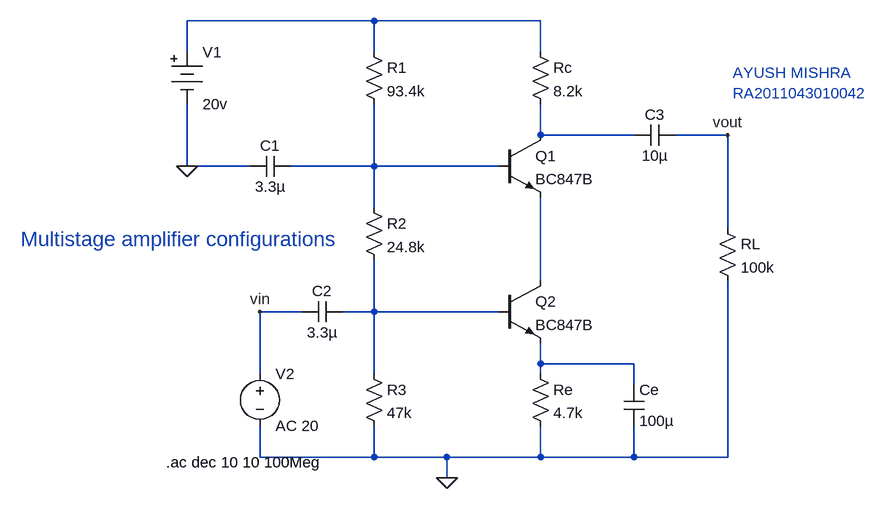
[diagram p0: schematic exp 3.asc]
exp 3.asc, the LTspice schematic file:
Version 4
SHEET 1 880 680
WIRE -16 -144 -304 -144
WIRE 240 -144 -16 -144
WIRE -304 -96 -304 -144
WIRE -16 -96 -16 -144
WIRE 240 -96 240 -144
WIRE 240 32 240 -16
WIRE 384 32 240 32
WIRE 528 32 448 32
WIRE -304 80 -304 -16
WIRE -208 80 -304 80
WIRE -16 80 -16 -16
WIRE -16 80 -144 80
WIRE 176 80 -16 80
WIRE -16 144 -16 80
WIRE 528 176 528 32
WIRE 240 256 240 128
WIRE -128 304 -192 304
WIRE -16 304 -16 224
WIRE -16 304 -64 304
WIRE 176 304 -16 304
WIRE 240 384 240 352
WIRE 384 384 240 384
WIRE -192 400 -192 304
WIRE -16 400 -16 304
WIRE 240 400 240 384
WIRE 384 416 384 384
WIRE -192 528 -192 480
WIRE -16 528 -16 480
WIRE -16 528 -192 528
WIRE 96 528 -16 528
WIRE 240 528 240 480
WIRE 240 528 96 528
WIRE 384 528 384 480
WIRE 384 528 240 528
WIRE 528 528 528 256
WIRE 528 528 384 528
WIRE 96 560 96 528
FLAG 96 560 0
FLAG -304 80 0
FLAG 528 32 vout
FLAG -192 304 vin
SYMBOL npn 176 32 R0
SYMATTR InstName Q1
SYMATTR Value BC847B
SYMBOL npn 176 256 R0
SYMATTR InstName Q2
SYMATTR Value BC847B
SYMBOL res -32 -112 R0
SYMATTR InstName R1
SYMATTR Value 93.4k
SYMBOL res -32 128 R0
SYMATTR InstName R2
SYMATTR Value 24.8k
SYMBOL res -32 384 R0
SYMATTR InstName R3
SYMATTR Value 47k
SYMBOL res 224 -112 R0
SYMATTR InstName Rc
SYMATTR Value 8.2k
SYMBOL res 224 384 R0
SYMATTR InstName Re
SYMATTR Value 4.7k
SYMBOL res 512 160 R0
SYMATTR InstName RL
SYMATTR Value 100k
SYMBOL Misc\\battery -304 -112 R0
WINDOW 123 0 0 Left 0
WINDOW 39 0 0 Left 0
SYMATTR InstName V1
SYMATTR Value 20v
SYMBOL voltage -192 384 R0
WINDOW 123 0 0 Left 0
WINDOW 39 0 0 Left 0
SYMATTR InstName V2
SYMATTR Value AC 20
SYMBOL cap -144 64 R90
WINDOW 0 0 32 VBottom 2
WINDOW 3 32 32 VTop 2
SYMATTR InstName C1
SYMATTR Value 3.3µ
SYMBOL cap -64 288 R90
WINDOW 0 0 32 VBottom 2
WINDOW 3 32 32 VTop 2
SYMATTR InstName C2
SYMATTR Value 3.3µ
SYMBOL cap 448 16 R90
WINDOW 0 0 32 VBottom 2
WINDOW 3 32 32 VTop 2
SYMATTR InstName C3
SYMATTR Value 10µ
SYMBOL cap 368 416 R0
SYMATTR InstName Ce
SYMATTR Value 100µ
TEXT -336 536 Left 2 !.ac dec 10 10 100Meg
TEXT 536 -64 Left 2 ;AYUSH MISHRA\nRA2011043010042
TEXT -560 192 Left 3 ;Multistage amplifier configurations

The netlist it stands for:
* exp 3.asc
Q1 N002 N003 N004 0 BC847B
Q2 N004 N005 N006 0 BC847B
R1 N001 N003 93.4k
R2 N003 N005 24.8k
R3 N005 0 47k
Rc N001 N002 8.2k
Re N006 0 4.7k
RL vout 0 100k
V1 N001 0 20v
V2 vin 0 AC 20
C1 N003 0 3.3µ
C2 N005 vin 3.3µ
C3 vout N002 10µ
Ce N006 0 100µ
.model NPN NPN
.model PNP PNP
.lib standard.bjt
.ac dec 10 10 100Meg
* AYUSH MISHRA
* RA2011043010042
* Multistage amplifier configurations
.backanno
.end